# Altium schematic sheet main.SchDoc
size A4
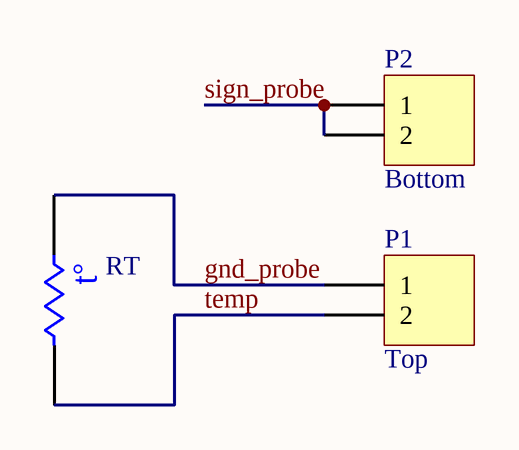
[diagram p0: main.SchDoc]

## Parts
P1  Top  [header2]
P2  Bottom  [header2]
RT  Res Thermal  [6-0805_M]  (value not drawn)

## Nets
gnd_probe: P1.1 RT.1
sign_probe: P2.1 P2.2
temp: P1.2 RT.2

## Notes on the sheet
- (in symbol Res Thermal) t°

## Library data of the parts
P1 P2 = Header 2: Header, 2-Pin; LatestRevisionDate: 17-Jul-2002; LatestRevisionNote: Re-released for DXP Platform.; Publisher: Altium Limited
RT = Res Thermal: Thermistor; Published: 24-Mar-1999; LatestRevisionDate: 29-May-2009; LatestRevisionNote: IPC-7351 Footprint Added.; PackageVersion: Mar-2003; PackageReference: 6-0805; Publisher: Altium Limited; PackageDescription: Chip Resistor 0805 Case Size; Code_IPC: RESC2012